# Altium schematic sheet ZigBee.SchDoc
size A4; SheetNumber: 1; SheetTotal: 2
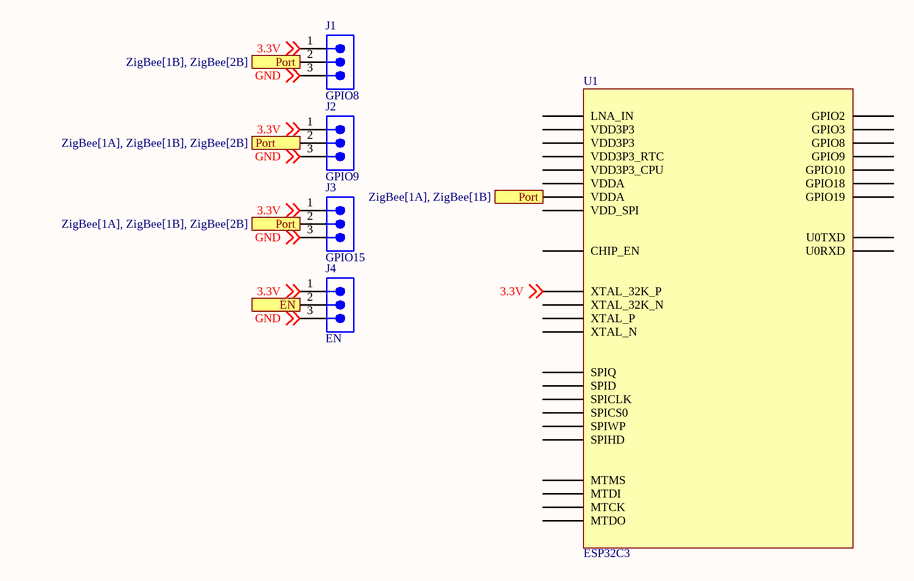
[diagram p0: ZigBee.SchDoc]

## Parts
J1  GPIO8  [61300311121]
J2  GPIO9  [61300311121]
J3  GPIO15  [61300311121]
J4  EN  [61300311121]
U1  ESP32C3  [QFN50P500X500X90_HS-33N]

## Ports
EN, Port (see ZigBee[1A], ZigBee[1B]), Port (see ZigBee[1A], ZigBee[1B], ZigBee[2B]), Port (see ZigBee[1B], ZigBee[2B])

## Nets
3.3V: J1.1 J2.1 J3.1 J4.1 U1.4(XTAL_32K_P) ; off-sheet 3.3V
EN: J4.2 ; port EN
GND: J1.3 J2.3 J3.3 J4.3 ; off-sheet GND
Port: J1.2 J2.2 J3.2 U1.31(VDDA) ; port Port

Not connected (* = marked no-connect by the designer): U1 1(LNA_IN) 2(VDD3P3) 3(VDD3P3) 5(XTAL_32K_N) 6(GPIO2) 7(CHIP_EN) 8(GPIO3) 9(MTMS) 10(MTDI) 11(VDD3P3_RTC) 12(MTCK) 13(MTDO) 14(GPIO8) 15(GPIO9) 16(GPIO10) 17(VDD3P3_CPU) 18(VDD_SPI) 19(SPIHD) 20(SPIWP) 21(SPICS0) 22(SPICLK) 23(SPID) 24(SPIQ) 25(GPIO18) 26(GPIO19) 27(U0RXD) 28(U0TXD) 29(XTAL_N) 30(XTAL_P) 32(VDDA)

## Library data of the parts
J1-J4 = CMP-1502-01062-3: NexarPartId: 32855521; Current Rating: 3A; Voltage Rating: 250V; Number of Positions: 3; Pitch: 2.54mm; Contact Resistance: 20mΩ; Connector Type: Male Pin; Gender: Male; REACH SVHC: Unknown; Packaging: Bulk; Contact Material: Copper; Min Operating Temperature: -40°C; Number of Rows: 1; Orientation: Vertical; RoHS: Compliant; Contact Plating: Gold; Max Operating Temperature: 105°C; Mount: Through Hole; Height: 8.94mm; Operating Supply Voltage: 250V; Number of Pins: 3; Contact Mating Length: 5.9944mm; Number of Contacts: 3; Color: Black; Lead Free: Lead Free; Lead Pitch: 2.54mm; Termination: Solder